# Altium schematic sheet Power.SchDoc
size A
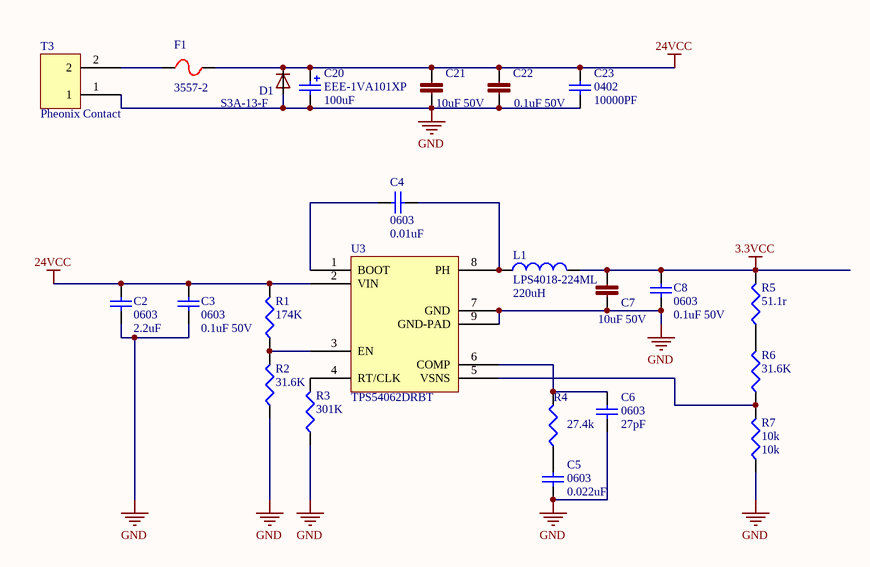
[diagram p0: Power.SchDoc]

## Parts
C2  0603  value 2.2uF  [C0805]
C3  0603  value 0.1uF 50V  [C0603]
C4  0603  value 0.01uF  [C0603]
C5  0603  value 0.022uF  [C0603]
C6  0603  value 27pF  [C0603]
C7  10uF 50V  [C1206]
C8  0603  value 0.1uF 50V  [C0603]
C20  EEE-1VA101XP  value 100uF  [EEE-1VA101XP]
C21  10uF 50V  [C1206]
C22  0.1uF 50V  [C0603]
C23  value 10000PF  [C0402]  (hidden comment: 0402)
D1  S3A-13-F  [DO-214AB]
F1  3557-2  [3557]
L1  LPS4018-224ML  value 220uH  [LPS4018-224ML]
R1  174K  [R0603]
R2  31.6K  [R0603]
R3  301K  [R0603]
R4  27.4k  [R0603]
R5  51.1r  [R0603]
R6  31.6K  [R0603]
R7  10k  [R0603]
T3  Pheonix Contact  [CON-PHEONIX-508-Alt]
U3  TPS54062DRBT  [QFN65P300X300X100_HS-17N]

## Nets
3.3VCC: C7.1 C8.2 L1.2 R5.2
24VCC: C2.2 C3.2 C20.1 C21.1 C22.1 C23.2 D1.C F1.2 R1.2 U3.2(VIN)
GND: C2.1 C3.1 C5.1 C6.1 C7.2 C8.1 C20.2 C21.2 C22.2 C23.1 D1.A R2.1 R3.1 R7.1 T3.1 U3.7(GND) U3.9(GND-PAD)
NetC4_1: C4.1 L1.1 U3.8(PH)
NetC4_2: C4.2 U3.1(BOOT)
NetC5_2: C5.2 R4.1
NetC6_2: C6.2 R4.2 U3.6(COMP)
NetF1_1: F1.1 T3.2
NetR1_1: R1.1 R2.2 U3.3(EN)
NetR3_2: R3.2 U3.4(RT/CLK)
NetR5_1: R5.1 R6.2
NetR6_1: R6.1 R7.2 U3.5(VSNS)

## Library data of the parts
C2 = CL21A225KB9LNNC: CAP CER 2.2UF 50V 10% X5R 0805; MFR: Samsung; Voltage: 50VDC; Published: 10 - Dec - 2014; LatestRevisionDate: April 2015; Component Type: Chip Capacitor; MFR Part #: CL21A225KB9LNNC; Part Description: CAP CER 2.2UF 50V 10% X5R 0805; Mounting Type: SMT 0805; Datasheet: http://www.samsungsem.com/kr/front/downloadcms.do?path=/kr/support/product-search/mlcc/__icsFiles/afieldfile/2014/11/05&fileName=S_CL21A225KB9LNNC.pdf; Height: 1mm; Tolerance: 10%; Digikey #: 1276-2409-1-ND; PackageReference: 0805
C3 C8 = CL10B104KB8SFNC: CAP CER 0.1UF 50V 10% X7R 0603; MFR: Samsung; Voltage: 50VDC; Published: 10 - Dec - 2014; LatestRevisionDate: April 2015; Component Type: Chip Capacitor; MFR Part #: CL10B104KB8SFNC; Part Description: CAP CER 0.1UF 50V 10% X7R 0603; Mounting Type: SMT 0603; Datasheet: http://www.samsungsem.com/kr/front/downloadcms.do?path=/kr/support/product-search/mlcc/__icsFiles/afieldfile/2014/11/05&fileName=S_CL10B104KB8SFNC.pdf; Height: 0.9mm; Tolerance: 10%; Digikey #: 1276-1936-1-ND; PackageReference: 0603
C4 = CL10B103KB8NCNC: CAP CER 10000PF 50V 10% X7R 0603; MFR: Samsung; Voltage: 50VDC; Published: 10 - Dec - 2014; LatestRevisionDate: April 2015; Component Type: Chip Capacitor; MFR Part #: CL10B103KB8NCNC; Part Description: CAP CER 10000PF 50V 10% X7R 0603; Mounting Type: SMT 0603; Datasheet: http://www.samsungsem.com/kr/front/downloadcms.do?path=/kr/support/product-search/mlcc/__icsFiles/afieldfile/2014/11/05&fileName=S_CL10B103KB8NCNC.pdf; Height: 0.9mm; Tolerance: 10%; Digikey #: 1276-1921-1-ND; PackageReference: 0603
C5 = CL10B223JB8NNNC: CAP CER 0.022UF 50V 5% X7R 0603; MFR: Samsung; Tolerance: 10%; Voltage: 50VDC; Published: 10 - Dec - 2014; LatestRevisionDate: April 2015; Component Type: Chip Capacitor; MFR Part #: CL10B223JB8NNNC; Part Description: CAP CER 0.022UF 50V 5% X7R 0603; Mounting Type: SMT 0603; Datasheet: http://www.samsungsem.com/kr/front/downloadcms.do?path=/kr/support/product-search/mlcc/__icsFiles/afieldfile/2014/11/05&fileName=S_CL10B223JB8NNNC.pdf; Height: 0.9mm; Digikey #: 1276-1996-1-ND; PackageReference: 0603
C6 = CL10C270JB8NNNC: CAP CER 27PF 50V 5% NP0 0603; MFR: Samsung; Voltage: 50VDC; Published: 10 - Dec - 2014; LatestRevisionDate: April 2015; Component Type: Chip Capacitor; MFR Part #: CL10C270JB8NNNC; Part Description: CAP CER 27PF 50V 5% NP0 0603; Mounting Type: SMT 0603; Datasheet: http://www.samsungsem.com/kr/front/downloadcms.do?path=/kr/support/product-search/mlcc/__icsFiles/afieldfile/2014/11/05&fileName=S_CL10C270JB8NNNC.pdf; Height: 0.9mm; Tolerance: 5%; Digikey #: 1276-1921-1-ND; PackageReference: 0603
C7 C21 = CL31A106KBHNNNE: CAP CER 10UF 50V 10% X5R 1206; Manufacturer: Samsung; LastRevisionNote: ImportComponents; Published: 25-mar-2015; Publisher: UltiMachine; LastRevisionDate: 25-mar-2015; ManufacturerPartNumber: CL31A106KBHNNNE; VALUE: 10uF 50V
C20 = EEE-1VA101XP: CAP ALUM 100UF 35V 20% SMD; Manufacture: Panasonic; Digikey Part #: PCE3951CT-ND; Price: $0.63; Mount Type: SMT Panasonic VS D Series; Status: Active; Height: 7.70mm; Datasheet: http://industrial.panasonic.com/www-cgi/jvcr13pz.cgi?E+PZ+3+ABA0002+EEE1VA101XP+7+WW; Manufacture Part #: EEE-1VA101XP
C22 = CL10B104KB8SFNC: CAP CER 0.1UF 50V 10% X7R 0603; LastRevisionNote: ImportComponents; Published: 23-Apr-2014; Publisher: UltiMachine; LastRevisionDate: 23-Apr-2014; ManufacturerPartNumber: CL10B104KB8SFNC; VALUE: 0.1uF 50V
C23 = CL05B103JB5NNNC: CAP CER 10000PF 50V 5% X7R 0402; Manufacturer: Samsung; Voltage: 16v; Published: 10 - Dec - 2014; LatestRevisionDate: 10 - Dec - 2014; LatestRevisionNote: Ultimachine Footprint Added; Publisher: Ultimachine; Component Type: Chip Capacitor; Manufacture Part #: CL05B103JB5NNNC; Part Description: CAP CER 10000PF 50V 5% X7R 0402; Mounting Type: SMT 0402; Datasheet: https://www.samsungsem.com/kr/front/downloadcms.do?path=/kr/support/product-search/mlcc/__icsFiles/afieldfile/2014/11/05&fileName=S_CL05B103JB5NNNC.pdf; Height: 0.25 ± 0.15mm; Tolerance: 5%; PackageReference: 0402
D1 = S3A-13-F: DIODE DO-214AB; LastRevisionNote: ImportComponents; Published: 23-Apr-2014; Publisher: UltiMachine; LastRevisionDate: 23-Apr-2014; Value: S3A-13-F
F1 = 3557-2: FUSE PTH ATO; LastRevisionNote: ImportComponents; Published: 23-Apr-2014; Publisher: UltiMachine; LastRevisionDate: 23-Apr-2014; ManufacturerPartNumber: 3557-2
L1 = LPS4018-224ML: Inductor; MFR: Coilcraft; Published: 8-Jun-2000; LatestRevisionDate: April 2015; PackageReference: Coilcraft Custom; Publisher: Altium Limited; PackageDescription: Custom Wound SMD Inductor; MFR#: LPS4018-224ML; Height: 1.7mm
R1 = RC1608F1743CS: RES SMD 174K OHM 1% 1/10W 0603; MFR: Samsung; PackageReference: 0603; MFR #: RC1608F1743CS; Digikey #: 1276-4857-1-ND; PDF: http://www.samsungsem.com/global/support/library/product-catalog/__icsFiles/afieldfile/2015/01/12/CHIP_RESISTOR_150112_1.pdf; Value: 174K
R2 R6 = RC1608F3162CS: RES SMD 31.6K OHM 1% 1/10W 0603; MFR: Samsung; PackageReference: 0603; MFR #: RC1608F3162CS; Digikey #: 1276-4788-1-ND; PDF: http://www.samsungsem.com/global/support/library/product-catalog/__icsFiles/afieldfile/2015/01/12/CHIP_RESISTOR_150112_1.pdf; Value: 31.6K
R3 = RC1608F3013CS: RES SMD 301K OHM 1% 1/10W 0603; MFR: Samsung; PackageReference: 0603; MFR #: RC1608F3013CS; Digikey #: 1276-4881-1-ND; PDF: http://www.samsungsem.com/global/support/library/product-catalog/__icsFiles/afieldfile/2015/01/12/CHIP_RESISTOR_150112_1.pdf; Value: 301K
R4 = RC1608F2742CS: RES SMD 27.4K OHM 1% 1/10W 0603; MFR: Samsung; PackageReference: 0603; MFR #: RC1608F2742CS; Digikey #: 1276-4782-1-ND; PDF: http://www.samsungsem.com/global/support/library/product-catalog/__icsFiles/afieldfile/2015/01/12/CHIP_RESISTOR_150112_1.pdf; Value: 27.4k
R5 = RC1608F51R1CS: RES SMD 51.1 OHM 1% 1/10W 0603; MFR: Samsung; PackageReference: 0603; MFR #: RC1608F51R1CS; Digikey #: 1276-4543-1-ND; PDF: http://www.samsungsem.com/global/support/library/product-catalog/__icsFiles/afieldfile/2015/01/12/CHIP_RESISTOR_150112_1.pdf; Value: 51.1r
R7 = RC1608J103CS: RES SMD 10K OHM 5% 1/10W 0603; MFR: Samsung; PackageReference: 0603; MFR #: RC1608J103CS; Digikey #: 1276-5086-1-ND; PDF: http://www.samsungsem.com/global/support/library/product-catalog/__icsFiles/afieldfile/2015/01/12/CHIP_RESISTOR_150112_1.pdf; Value: 10k
T3 = Pheonix Contact 2X1
U3 = TPS54062DRBT: IC REG BUCK SYNC ADJ 50MA DRBT; MFR: Texas Instruments; MFR#: TPS54062DRBT; Type: DCDC Switching Step Down Regulator IC